# Altium schematic sheet 51-2001-01-10_04 Power Module Schematic.SchDoc
size 431 x 279 mm; Organization: ORGANIZATION; Address1: ADDRESS 1; Address2: ADDRESS 2; Address3: ADDRESS 3; Address4: ADDRESS 4; Revision: -; SheetNumber: 4; SheetTotal: 4; ENG_APP_DATE: --/--/--; DSN_APP_DATE: --/--/--; CHK_APP_DATE: --/--/--
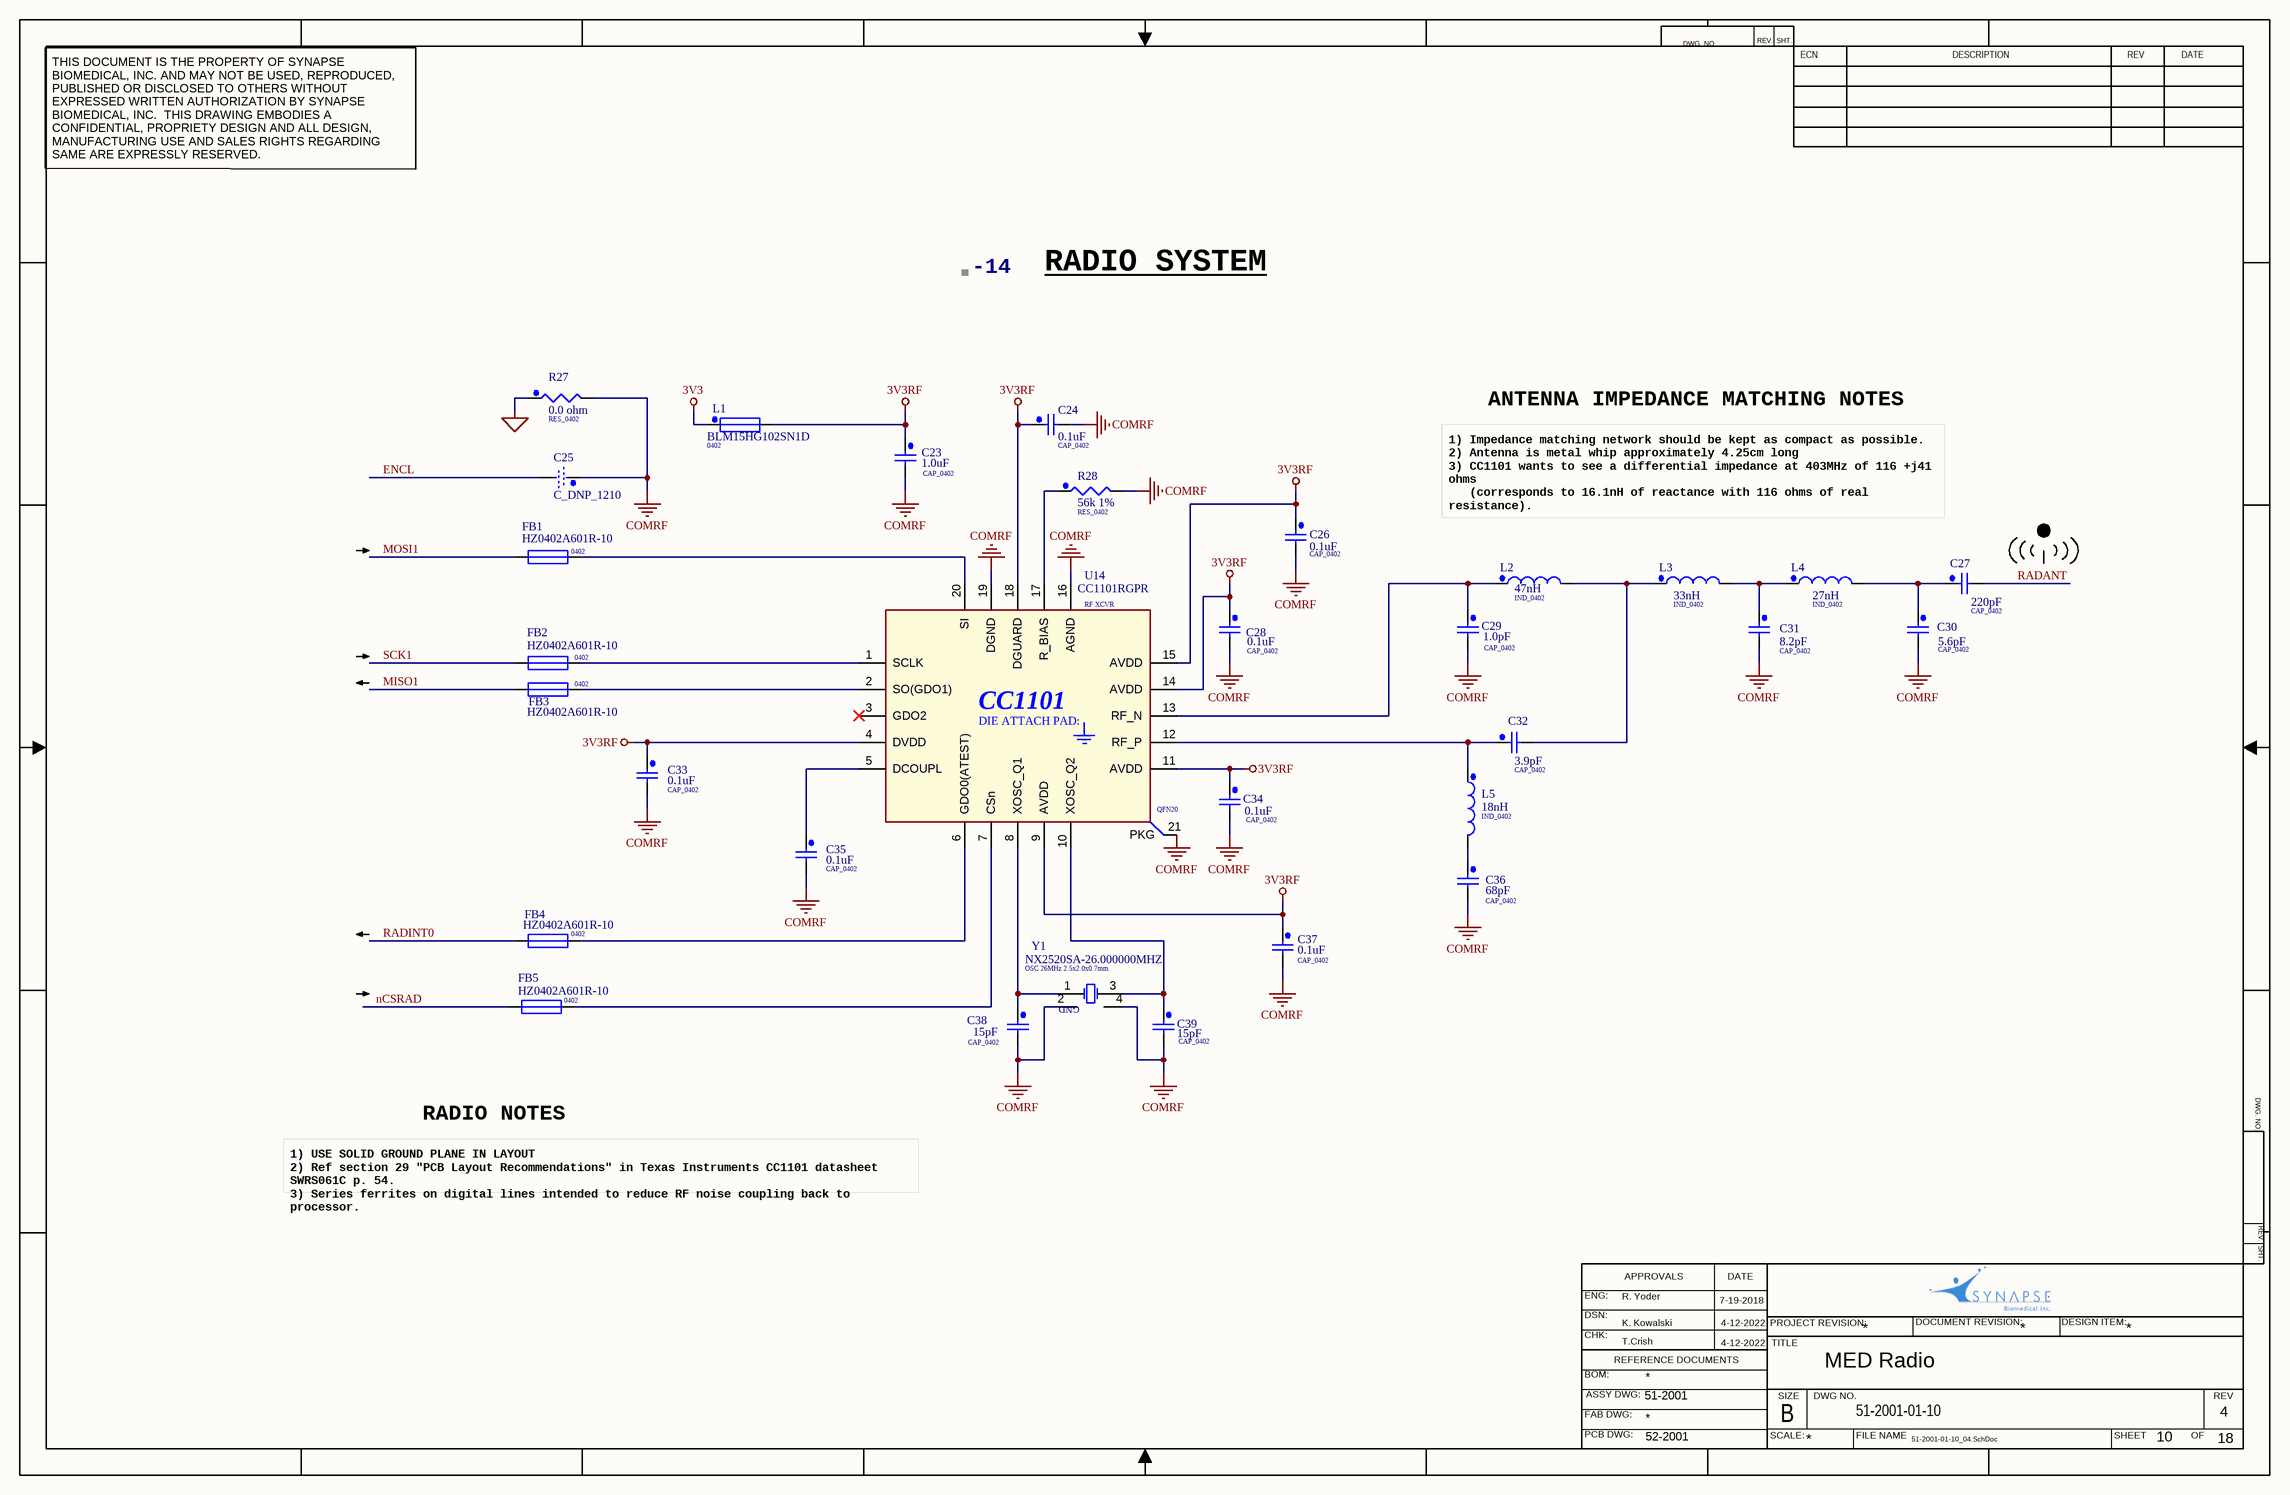
[diagram p0: 51-2001-01-10_04 Power Module Schematic.SchDoc]

## Parts
-14  XDESCRIPTION: RADIO SYSTEM  (hidden comment: BOM_S1)  (graphical)
C23  value 1.0uF  [CAP_0402]  (hidden comment: C_1u_X5R_6V3_0402_20%)
C24  value 0.1uF  [CAP_0402]  (hidden comment: C_100n_X7R_16_0402_10%)
C25  C_DNP_1210  [CAP_1210]  (no BOM)
C26  value 0.1uF  [CAP_0402]  (hidden comment: C_100n_X7R_16_0402_10%)
C27  value 220pF  [CAP_0402]  (hidden comment: C_220p_C0G_50_0402_5%)
C28  value 0.1uF  [CAP_0402]  (hidden comment: C_100n_X7R_16_0402_10%)
C29  value 1.0pF  [CAP_0402]  (hidden comment: C_1p_C0G_50_0402_5%)
C30  value 5.6pF  [CAP_0402]  (hidden comment: C_5p6_C0G_50_0402_10%)
C31  value 8.2pF  [CAP_0402]  (hidden comment: 8.2pF_C0G_50_0402_5%)
C32  value 3.9pF  [CAP_0402]  (hidden comment: C_3p9_C0G_50_0402_10%)
C33  value 0.1uF  [CAP_0402]  (hidden comment: C_100n_X7R_16_0402_10%)
C34  value 0.1uF  [CAP_0402]  (hidden comment: C_100n_X7R_16_0402_10%)
C35  value 0.1uF  [CAP_0402]  (hidden comment: C_100n_X7R_16_0402_10%)
C36  value 68pF  [CAP_0402]  (hidden comment: C_68p_C0G_50_0402_5%)
C37  value 0.1uF  [CAP_0402]  (hidden comment: C_100n_X7R_16_0402_10%)
C38  value 15pF  [CAP_0402]  (hidden comment: C_15p_C0G_50_0402_5%)
C39  value 15pF  [CAP_0402]  (hidden comment: C_15p_C0G_50_0402_5%)
FB1  PackageDescription: 0402  [IND_0402]  (hidden comment: Ferrite 100mA 1ohm)
FB2  PackageDescription: 0402  [IND_0402]  (hidden comment: Ferrite 100mA 1ohm)
FB3  PackageDescription: 0402  [IND_0402]  (hidden comment: Ferrite 100mA 1ohm)
FB4  PackageDescription: 0402  [IND_0402]  (hidden comment: Ferrite 100mA 1ohm)
FB5  PackageDescription: 0402  [IND_0402]  (hidden comment: Ferrite 100mA 1ohm)
L1  PackageDescription: 0402  [IND_0402]  (hidden comment: Ferrite 250mA 1.1ohm)
L2  value 47nH  [IND_0402]  (hidden comment: 47nF, 0402, 5%, RoHS)
L3  value 33nH  [IND_0402]  (hidden comment: L_33n_0402_5%)
L4  value 27nH  [IND_0402]  (hidden comment: L_27n_0402_5%)
L5  value 18nH  [IND_0402]  (hidden comment: L_18n_0402_5%)
R27  value 0.0 ohm  [RES_0402]  (hidden comment: R_0_0402)
R28  value 56k 1%  [RES_0402]  (hidden comment: R_56k_0402)
U14  RF XCVR  MPN: CC1101RGPR  [QFN20]
Y1  OSC 26MHz 2.5x2.0x0.7mm  [NX2520SA]

## Nets
3V3: L1.1
3V3RF: C23.1 C24.1 C26.1 C28.1 C33.1 C34.1 C37.1 L1.2 U14.4(DVDD) U14.9(AVDD) U14.11(AVDD) U14.14(AVDD) U14.15(AVDD) U14.18(DGUARD)
COMRF: C23.2 C24.2 C25.1 C26.2 C28.2 C29.2 C30.2 C31.2 C33.2 C34.2 C35.2 C36.2 C37.2 C38.2 C39.2 R27.2 R28.2 U14.16(AGND) U14.19(DGND) U14.21(PKG) Y1.2(GND) Y1.4(GND)
GND: R27.1
ENCL: C25.2
MISO1: FB3.1
MOSI1: FB1.1
nCSRAD: FB5.1
RADANT: C27.2
RADINT0: FB4.1
SCK1: FB2.1
NetC27_1: C27.1 C30.1 L4.2
NetC29_1: C29.1 L2.1 U14.13(RF_N)
NetC31_1: C31.1 L3.2 L4.1
NetC32_1: C32.1 L5.1 U14.12(RF_P)
NetC32_2: C32.2 L2.2 L3.1
NetC35_1: C35.1 U14.5(DCOUPL)
NetC36_1: C36.1 L5.2
NetC38_1: C38.1 U14.8(XOSC_Q1) Y1.1(OSC1)
NetC39_1: C39.1 U14.10(XOSC_Q2) Y1.3(OSC2)
NetFB1_2: FB1.2 U14.20(SI)
NetFB2_2: FB2.2 U14.1(SCLK)
NetFB3_2: FB3.2 U14.2(SO(GDO1))
NetFB4_2: FB4.2 U14.6(GDO0(ATEST))
NetFB5_2: FB5.2 U14.7(CSn)
NetR28_1: R28.1 U14.17(R_BIAS)

Not connected (* = marked no-connect by the designer): U14 3(GDO2)*

## Notes on the sheet
- DWG. NO.
- REV.
- SHT.
- ECN
- DESCRIPTION
- REV
- DATE
- THIS DOCUMENT IS THE PROPERTY OF SYNAPSE BIOMEDICAL, INC. AND MAY NOT BE USED, REPRODUCED, PUBLISHED OR DISCLOSED TO OTHERS WITHOUT EXPRESSED WRITTEN AUTHORIZATION BY SYNAPSE BIOMEDICAL, INC.  THIS DRAWING EMBODIES A CONFIDENTIAL, PROPRIETY DESIGN AND ALL DESIGN, MANUFACTURING USE AND SALES RIGHTS REGARDING SAME ARE EXPRESSLY RESERVED.
- ANTENNA IMPEDANCE MATCHING NOTES
- 1) Impedance matching network should be kept as compact as possible.
  2) Antenna is metal whip approximately 4.25cm long
  3) CC1101 wants to see a differential impedance at 403MHz of 116 +j41 ohms
  (corresponds to 16.1nH of reactance with 116 ohms of real resistance).
- RADIO NOTES
- 1) USE SOLID GROUND PLANE IN LAYOUT
  2) Ref section 29 "PCB Layout Recommendations" in Texas Instruments CC1101 datasheet SWRS061C p. 54.
  3) Series ferrites on digital lines intended to reduce RF noise coupling back to processor.
- ENG:
- R. Yoder
- APPROVALS
- 7-19-2018
- DSN:
- CHK:
- REFERENCE DOCUMENTS
- K. Kowalski
- T.Crish
- 4-12-2022
- PROJECT REVISION:
- TITLE
- MED Radio
- *
- DOCUMENT REVISION:
- DESIGN ITEM:
- BOM:
- FAB DWG:
- PCB DWG:
- ASSY DWG:
- 51-2001
- SCALE:
- SIZE
- B
- DWG NO.
- 51-2001-01-10
- FILE NAME
- SHEET
- OF
- 4
- 52-2001
- 51-2001-01-10_04.SchDoc
- 10
- 18
- (in symbol CC1101RTK) CC1101; DIE ATTACH PAD:

## Library data of the parts
-14 = BOM_S1: BOM item small graphic
C23 = ECJ-0EB0J105M: 1.0uF, 6.3V, X5R, 20%, 0402, RoHS; MFR: Murata Electronics North America; MPN: GRM152R60J105ME15D; SBI: 53-0078; PackageDescription: CAP_0402; Supplier 1: Digi-Key; Supplier Part Number 1: 490-10006-6-ND
C24 C26 C28 C33-C35 C37 = GRM155R71C104KA88D: 0.1uF, 16V, X7R, 0402, RoHS; MFR: Murata; SBI: 53-0040-1; PackageDescription: CAP_0402; Supplier 1: Digi-Key; Supplier Part Number 1: 490-3261-2-ND; MPN: GRM155R71C104KA88D
C25 = C_DNP_1210: MFR: DO NOT POPULATE; PackageDescription: 1210; Supplier 1: DO NOT POPULATE; Supplier Part Number 1: DO NOT POPULATE; MPN: DO NOT POPULATE
C27 = GRM1555C1H221JA01: 220pF, 50V, C0G 5%, 0402, RoHS; MFR: Murata Electronics North America; SBI: 53-0041-4; PackageDescription: CAP_0402; Supplier 1: Digi-Key; Supplier Part Number 1: 490-1293-6-ND; MPN: GRM1555C1H221JA01; Supplier 2: Digi-Key; Supplier Part Number 2: 399-7776-6-ND; MFR2: Kemet; MPN2: C0402C221J5GACTU
C29 = GRM1555C1H1R0CA01D: 1.0pF, 50V, C0G, 25%, 0402, RoHS; MFR: Murata Electronics North America; SBI: 53-0092; PackageDescription: CAP_0402; Supplier 1: Digi-Key; Supplier Part Number 1: 490-3199-6-ND; MPN: GRM1555C1H1R0CA01D
C30 = GRM1555C1H5R6DZ01: 5.6pF, 50V, C0G, 10%, 0402, RoHS; MFR: Murata Electronics North America; MPN: GRM1555C1H5R6DA01D; SBI: 53-0044-1; PackageDescription: CAP_0402; Supplier 1: Digi-Key; Supplier Part Number 1: 490-5946-6-ND
C31 = C1005C0G1H8R2C: 8.2pF, 50V, C0G, 5%, 0402, RoHS; MFR: KEMET; MPN: C0402C829J5GACTU; SBI: 53-0041-5; PackageDescription: CAP_0402; Supplier 1: Digi-Key; Supplier Part Number 1: 399-10038-6-ND
C32 = GRM1555C1H3R9CZ01: 3.9pF, 50V, C0G, 10%, 0402, RoHS; MFR: Murata Electronics North America; MPN: GRM1555C1H3R9CA01D; SBI: 53-0044-2; PackageDescription: CAP_0402; Supplier 1: Digi-Key; Supplier Part Number 1: 490-5940-6-ND
C36 = GRM1555C1H680JZ01D: 68pF, 50V, C0G, 0402, 5%, RoHS; MFR: Murata Electronics North America; MPN: GRM1555C1H680JA01D; SBI: 53-00041-1; PackageDescription: CAP_0402; Supplier 1: Digi-Key; Supplier Part Number 1: 490-5876-6-ND
C38 C39 = 04025A150JAT2A: 15pF, 50V, C0G, 5%, 0402, RoHS; MFR: Murata Electronics North America; MPN: GRM1555C1H150JA01D; SBI: 53-0041-6; PackageDescription: CAP_0402; Supplier 1: Digi-Key; Supplier Part Number 1: 490-5888-6-ND
FB1-FB5 = HZ0402A601R-10: Ferrite, 100mA, 1ohm, 0402, RoHS; MFR: Laird-Signal Integrity Products; SBI: 54-0114; Supplier 1: Digi-Key; Supplier Part Number 1: 240-2364-2-ND; MPN: HZ0402A601R-10
L1 = BLM15HG102SN1D: Ferrite, 250mA, 1.1ohm, 0402, RoHS; MFR: Murata; SBI: 53-0094; Supplier 1: Digi-Key; Supplier Part Number 1: 490-3999-1-ND; Value: 250mA; MPN: BLM15HG102SN1D
L2 = 0402CS-47NXJLU: MFR: Coilcraft; SBI: 53-0089-4; ComponentLink1URL: http://www.coilcraft.com/0402cs.cfm; PackageDescription: IND_0402; Supplier 1: MOUSER; Supplier Part Number 1: 994-0402CS-47NXJLU; MPN: 0402CS-47NXJLU
L3 = 0402CS-33NXJLU: 33nH, 0402, 5%, RoHS; MFR: Coilcraft; SBI: 53-0089-3; PackageDescription: IND_0402; Supplier 1: MOUSER; Supplier Part Number 1: 994-0402CS-33NXJLU; MPN: 0402CS-33NXJLU
L4 = 0402CS-27NXJLU: 27nH, 0402, 5%, RoHS; MFR: Coilcraft; PackageDescription: IND_0402; Supplier 1: MOUSER; Supplier Part Number 1: 994-0402CS-27NXJLU; MPN: 0402CS-27NXJLU; MPN2: 0402CS-27NXJLW
L5 = 0402CS-18NXJLU: 18nH, 0402, 5%, RoHS; MFR: Coilcraft; SBI: 53-0089-1; PackageDescription: IND_0402; Supplier 1: MOUSER; Supplier Part Number 1: 994-0402CS-18NXJLU; MPN: 0402CS-18NXJLU
R27 = MCR01MZPJ000: 0.0 ohm, 1/16W, 0402, RoHS; MFR: Vishay Dale; MPN: CRCW04021K00FKED; SBI: 53-0048; PackageDescription: RES_0402; Supplier 1: Digi-Key; Supplier Part Number 1: 541-1.00KLDKR-ND
R28 = MCR01MZPF5602: 56k ohm, 1%, 1/16 W, 0402, RoHS; MFR: Rohm; PackageDescription: RES_0402; Supplier 1: Digi-Key; Supplier Part Number 1: RHM56.0KLCT-ND; MPN: MCR01MZPF5602
U14 = CC1101RTK: Low-Power Sub-1 GHz RF Transceiver, QFN20, RoHS; MFR: Texas Instruments; SBI: 54-0095; Supplier 1: Digi-Key; Supplier Part Number 1: 296-35718-6-ND; PackageDescription: QFN20; Value: *
Y1 = NX2520SA-26.000000MHZ: Xtal, 26MHz,  2.5x2.0x0.7mm, RoHS; MFR: NDK; SBI: 54-0109; Supplier 1: Digi-Key; Supplier Part Number 1: 644-1063-1-ND; VALUE: 26MHz; MPN: NX2520SA-26.000000MHZ